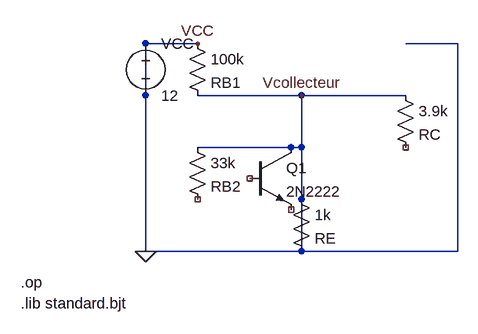
[diagram p0: schematic polarisation_base.asc]
polarisation_base.asc, the LTspice schematic file:
Version 4
SHEET 1 1000 800
WIRE 160 80 160 400
WIRE 240 80 160 80
WIRE 560 80 640 80
WIRE 640 80 640 400
WIRE 160 400 640 400
WIRE 240 160 320 160
WIRE 400 160 400 240
WIRE 320 160 400 160
WIRE 400 240 400 400
WIRE 240 240 320 240
WIRE 320 240 400 240
WIRE 560 160 400 160
FLAG 160 400 0
FLAG 240 80 VCC
FLAG 400 160 Vcollecteur
SYMBOL voltage 160 64 R0
WINDOW 123 0 0 Left 0
WINDOW 39 0 0 Left 0
SYMATTR InstName VCC
SYMATTR Value 12
SYMBOL res 224 64 R0
WINDOW 0 36 76 Left 2
WINDOW 3 36 40 Left 2
SYMATTR InstName RB1
SYMATTR Value 100k
SYMBOL res 224 224 R0
WINDOW 0 36 76 Left 2
WINDOW 3 36 40 Left 2
SYMATTR InstName RB2
SYMATTR Value 33k
SYMBOL res 544 144 R0
WINDOW 0 36 76 Left 2
WINDOW 3 36 40 Left 2
SYMATTR InstName RC
SYMATTR Value 3.9k
SYMBOL res 384 304 R0
WINDOW 0 36 76 Left 2
WINDOW 3 36 40 Left 2
SYMATTR InstName RE
SYMATTR Value 1k
SYMBOL npn 320 240 R0
SYMATTR InstName Q1
SYMATTR Value 2N2222
TEXT -32 448 Left 2 !.op
TEXT -32 480 Left 2 !.lib standard.bjt

The netlist it stands for:
* polarisation_base.asc
VCC 0 0 12
RB1 0 0 100k
RB2 0 NC_01 33k
RC 0 NC_02 3.9k
RE 0 0 1k
Q1 0 NC_03 NC_04 0 2N2222
.model NPN NPN
.model PNP PNP
.lib standard.bjt
.op
.lib standard.bjt
.backanno
.end